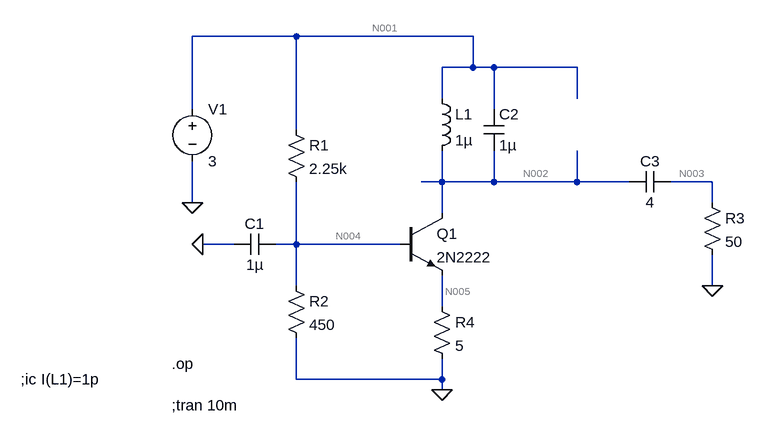
[diagram p0: schematic osc3.asc]
osc3.asc, the LTspice schematic file:
Version 4
SHEET 1 880 680
WIRE -48 -192 -208 -192
WIRE 224 -192 -48 -192
WIRE 224 -144 224 -192
WIRE 224 -144 176 -144
WIRE 256 -144 224 -144
WIRE 384 -144 256 -144
WIRE 176 -96 176 -144
WIRE 384 -96 384 -144
WIRE -208 -80 -208 -192
WIRE 256 -80 256 -144
WIRE -48 -48 -48 -192
WIRE 176 32 176 -16
WIRE 176 32 144 32
WIRE 256 32 256 -16
WIRE 256 32 176 32
WIRE 384 32 384 -16
WIRE 384 32 256 32
WIRE 464 32 384 32
WIRE 592 32 528 32
WIRE -208 64 -208 0
WIRE 592 64 592 32
WIRE 176 80 176 32
WIRE -144 128 -192 128
WIRE -48 128 -48 32
WIRE -48 128 -80 128
WIRE 112 128 -48 128
WIRE -48 192 -48 128
WIRE 592 192 592 144
WIRE 176 224 176 176
WIRE -48 336 -48 272
WIRE 176 336 176 304
WIRE 176 336 -48 336
WIRE 176 352 176 336
FLAG 176 352 0
FLAG -208 64 0
FLAG 592 192 0
FLAG -192 128 0
SYMBOL npn 112 80 R0
SYMATTR InstName Q1
SYMATTR Value 2N2222
SYMBOL cap 240 -80 R0
SYMATTR InstName C2
SYMATTR Value 1µ
SYMBOL ind 160 -112 R0
SYMATTR InstName L1
SYMATTR Value 1µ
SYMBOL voltage -208 -96 R0
WINDOW 123 0 0 Left 0
WINDOW 39 0 0 Left 0
SYMATTR InstName V1
SYMATTR Value 3
SYMBOL cap 528 16 R90
WINDOW 0 0 32 VBottom 2
WINDOW 3 32 32 VTop 2
SYMATTR InstName C3
SYMATTR Value 4
SYMBOL res 576 48 R0
SYMATTR InstName R3
SYMATTR Value 50
SYMBOL res -64 -64 R0
SYMATTR InstName R1
SYMATTR Value 2.25k
SYMBOL res -64 176 R0
SYMATTR InstName R2
SYMATTR Value 450
SYMBOL res 160 208 R0
SYMATTR InstName R4
SYMATTR Value 5
SYMBOL cap -80 112 R90
WINDOW 0 0 32 VBottom 2
WINDOW 3 32 32 VTop 2
SYMATTR InstName C1
SYMATTR Value 1µ
TEXT -240 376 Left 2 !;tran 10m
TEXT -472 336 Left 2 !;ic I(L1)=1p
TEXT -240 312 Left 2 !.op

The netlist it stands for:
* osc3.asc
Q1 N002 N004 N005 0 2N2222
C2 N001 N002 1µ
L1 N001 N002 1µ
V1 N001 0 3
C3 N003 N002 4
R3 N003 0 50
R1 N001 N004 2.25k
R2 N004 0 450
R4 N005 0 5
C1 N004 0 1µ
.model NPN NPN
.model PNP PNP
.lib standard.bjt
;tran 10m
;ic I(L1)=1p
.op
.backanno
.end

* Results of the author's LTspice run, read from the files saved beside the schematic
* Operating Point:
*   V(n002) = 3 V
*   V(n004) = 500 mV
*   V(n005) = 12.79 µV
*   V(n001) = 3 V
*   V(n003) = 600 pV
*   Ic(Q1) = 2.546 µA
*   Ib(Q1) = 12.42 nA
*   Ie(Q1) = -2.558 µA
*   I(C2) = 0 A
*   I(C3) = -12 pA
*   I(C1) = 0 A
*   I(L1) = 2.546 µA
*   I(R3) = 12 pA
*   I(R1) = 1.111 mA
*   I(R2) = 1.111 mA
*   I(R4) = 2.558 µA
*   I(V1) = -1.114 mA
* From the log:
*   Semiconductor Device Operating Points:
*                           --- Bipolar Transistors ---
*   Name:       q1
*   Model:    2n2222
*   Ib:       1.24e-08
*   Ic:       2.55e-06
*   Vbe:      5.00e-01
*   Vbc:     -2.50e+00
*   Vce:      3.00e+00
*   BetaDC:   2.05e+02
*   Gm:       9.84e-05
*   Rpi:      2.08e+06
*   Rx:       1.00e+01
*   Ro:       4.03e+07
*   Cbe:      3.49e-11
*   Cbc:      4.93e-12
*   Cjs:      0.00e+00
*   BetaAC:   2.05e+02
*   Cbx:      0.00e+00
*   Ft:       3.93e+05